# Altium project B100.PrjPcb (part 5 of 7)

## Sheet Filter Capacitors - IoT UART.SchDoc: IoT UART Filter Capacitors
size A4; ApprovedBy: Mehmet Günce Akkoyun; CheckedBy: Mehmet Günce Akkoyun; Author: Mehmet Günce Akkoyun; CompanyName: Ovoo Electronics; DrawnBy: Mehmet Günce Akkoyun; Engineer: Mehmet Günce Akkoyun; Organization: Ovoo Electronics; Address1: Necip Fazıl Mah. Ortaırmak Sok.; Address2: Birgül Apt. No: 19/6; Address3: Meram / Konya; Address4: Turkiye; DocumentNumber: 39; Revision: R06; SheetNumber: 39; SheetTotal: 54
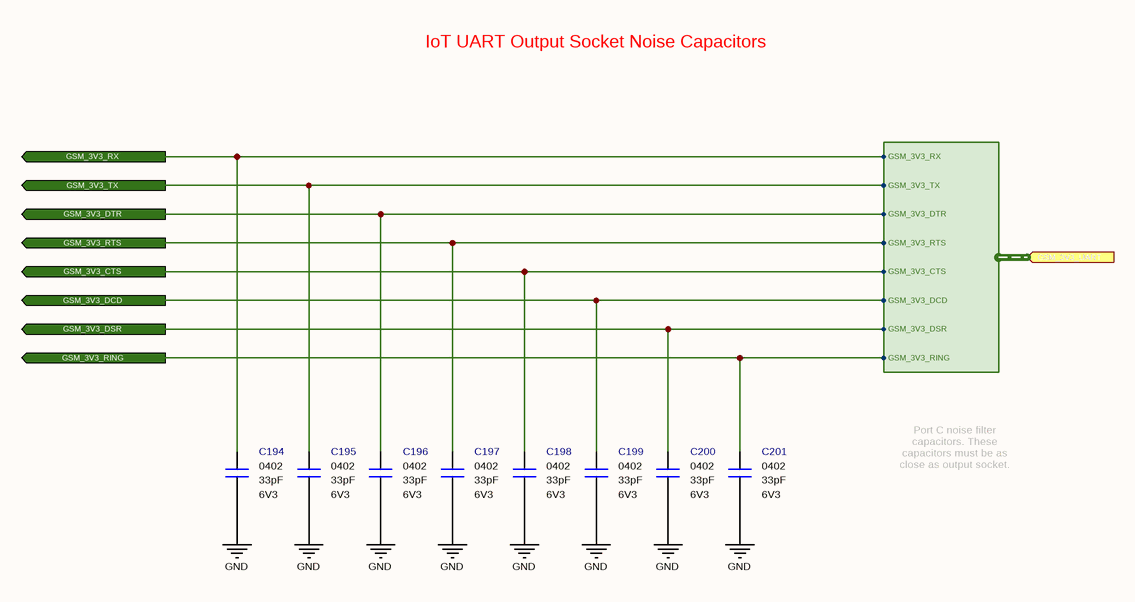
[diagram p46: Filter Capacitors - IoT UART.SchDoc]

### Parts
C194  value 33pF  Case: 0402  Voltage: 6V3  [CAPACITOR_0402]  (hidden comment: Multilayer Ceramic Capacitor)
C195  value 33pF  Case: 0402  Voltage: 6V3  [CAPACITOR_0402]  (hidden comment: Multilayer Ceramic Capacitor)
C196  value 33pF  Case: 0402  Voltage: 6V3  [CAPACITOR_0402]  (hidden comment: Multilayer Ceramic Capacitor)
C197  value 33pF  Case: 0402  Voltage: 6V3  [CAPACITOR_0402]  (hidden comment: Multilayer Ceramic Capacitor)
C198  value 33pF  Case: 0402  Voltage: 6V3  [CAPACITOR_0402]  (hidden comment: Multilayer Ceramic Capacitor)
C199  value 33pF  Case: 0402  Voltage: 6V3  [CAPACITOR_0402]  (hidden comment: Multilayer Ceramic Capacitor)
C200  value 33pF  Case: 0402  Voltage: 6V3  [CAPACITOR_0402]  (hidden comment: Multilayer Ceramic Capacitor)
C201  value 33pF  Case: 0402  Voltage: 6V3  [CAPACITOR_0402]  (hidden comment: Multilayer Ceramic Capacitor)

### Ports
GSM_3V3_CTS (out), GSM_3V3_DCD (out), GSM_3V3_DSR (out), GSM_3V3_DTR (out), GSM_3V3_RING (out), GSM_3V3_RTS (out), GSM_3V3_RX (out), GSM_3V3_TX (out), GSM_3V3_UART (in, harness GSM_3V3_UART)

### Harnesses
GSM_3V3_UART: GSM_3V3_RX, GSM_3V3_TX, GSM_3V3_DTR, GSM_3V3_RTS, GSM_3V3_CTS, GSM_3V3_DCD, GSM_3V3_DSR, GSM_3V3_RING

### Nets
GND: C194.1 C195.1 C196.1 C197.1 C198.1 C199.1 C200.1 C201.1
GSM_3V3_UART.GSM_3V3_CTS: C198.2 ; port GSM_3V3_CTS, port GSM_3V3_UART.GSM_3V3_CTS
GSM_3V3_UART.GSM_3V3_DCD: C199.2 ; port GSM_3V3_DCD, port GSM_3V3_UART.GSM_3V3_DCD
GSM_3V3_UART.GSM_3V3_DSR: C200.2 ; port GSM_3V3_DSR, port GSM_3V3_UART.GSM_3V3_DSR
GSM_3V3_UART.GSM_3V3_DTR: C196.2 ; port GSM_3V3_DTR, port GSM_3V3_UART.GSM_3V3_DTR
GSM_3V3_UART.GSM_3V3_RING: C201.2 ; port GSM_3V3_RING, port GSM_3V3_UART.GSM_3V3_RING
GSM_3V3_UART.GSM_3V3_RTS: C197.2 ; port GSM_3V3_RTS, port GSM_3V3_UART.GSM_3V3_RTS
GSM_3V3_UART.GSM_3V3_RX: C194.2 ; port GSM_3V3_RX, port GSM_3V3_UART.GSM_3V3_RX
GSM_3V3_UART.GSM_3V3_TX: C195.2 ; port GSM_3V3_TX, port GSM_3V3_UART.GSM_3V3_TX

### Notes on the sheet
- IoT UART Output Socket Noise Capacitors
- Port C noise filter capacitors. These capacitors must be as close as output socket.
- Title
- Size:
- Date:
- A4
- Number:
- Time:
- Revision:
- Sheet
- of
- File:

### Library data of the parts
C194-C201 = Capacitor - 33pF [0402-6V3]: as C102-C129 on sheet Module Output Sockets; Height: 0.5mm; Maximum Operating Temperature: +125; Minimum Operating Temperature: -55; ROHS: Yes; ComponentLink1Description: DataSheet; ComponentLink1URL: https://api.kemet.com/component-edge/download/datasheet/C0402C330J9RACAUTO.pdf; ComponentLink2Description: Mouser; ComponentLink2URL: https://www.mouser.com/Search/Refine.aspx?Keyword=80-C0402C330J9RAUTO; Supplier 1: Mouser; Supplier Part Number 1: 80-C0402C330J9RAUTO; Mouser Part Number: 80-C0402C330J9RAUTO

## Sheet Filter Capacitors - Port F.SchDoc: PORT F Filter Capacitors
size A4; ApprovedBy: Mehmet Günce Akkoyun; CheckedBy: Mehmet Günce Akkoyun; Author: Mehmet Günce Akkoyun; CompanyName: Ovoo Electronics; DrawnBy: Mehmet Günce Akkoyun; Engineer: Mehmet Günce Akkoyun; Organization: Ovoo Electronics; Address1: Necip Fazıl Mah. Ortaırmak Sok.; Address2: Birgül Apt. No: 19/6; Address3: Meram / Konya; Address4: Turkiye; DocumentNumber: 40; Revision: R06; SheetNumber: 40; SheetTotal: 54
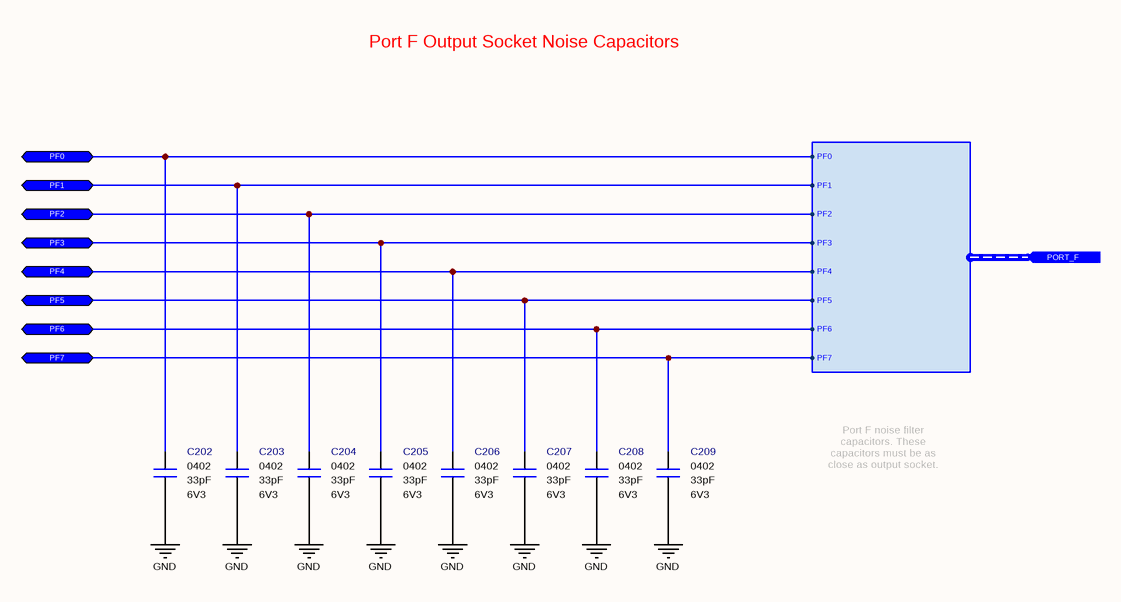
[diagram p47: Filter Capacitors - Port F.SchDoc]

### Parts
C202  value 33pF  Case: 0402  Voltage: 6V3  [CAPACITOR_0402]  (hidden comment: Multilayer Ceramic Capacitor)
C203  value 33pF  Case: 0402  Voltage: 6V3  [CAPACITOR_0402]  (hidden comment: Multilayer Ceramic Capacitor)
C204  value 33pF  Case: 0402  Voltage: 6V3  [CAPACITOR_0402]  (hidden comment: Multilayer Ceramic Capacitor)
C205  value 33pF  Case: 0402  Voltage: 6V3  [CAPACITOR_0402]  (hidden comment: Multilayer Ceramic Capacitor)
C206  value 33pF  Case: 0402  Voltage: 6V3  [CAPACITOR_0402]  (hidden comment: Multilayer Ceramic Capacitor)
C207  value 33pF  Case: 0402  Voltage: 6V3  [CAPACITOR_0402]  (hidden comment: Multilayer Ceramic Capacitor)
C208  value 33pF  Case: 0402  Voltage: 6V3  [CAPACITOR_0402]  (hidden comment: Multilayer Ceramic Capacitor)
C209  value 33pF  Case: 0402  Voltage: 6V3  [CAPACITOR_0402]  (hidden comment: Multilayer Ceramic Capacitor)

### Ports
PF0 (bidir), PF1 (bidir), PF2 (bidir), PF3 (bidir), PF4 (bidir), PF5 (bidir), PF6 (bidir), PF7 (bidir), PORT_F (in, harness PORT_F)

### Harnesses
PORT_F: PF0, PF1, PF2, PF3, PF4, PF5, PF7, PF6

### Nets
GND: C202.1 C203.1 C204.1 C205.1 C206.1 C207.1 C208.1 C209.1
PORT_F.PF0: C202.2 ; port PF0, port PORT_F.PF0
PORT_F.PF1: C203.2 ; port PF1, port PORT_F.PF1
PORT_F.PF2: C204.2 ; port PF2, port PORT_F.PF2
PORT_F.PF3: C205.2 ; port PF3, port PORT_F.PF3
PORT_F.PF4: C206.2 ; port PF4, port PORT_F.PF4
PORT_F.PF5: C207.2 ; port PF5, port PORT_F.PF5
PORT_F.PF6: C208.2 ; port PF6, port PORT_F.PF6
PORT_F.PF7: C209.2 ; port PF7, port PORT_F.PF7

### Notes on the sheet
- Port F Output Socket Noise Capacitors
- Port F noise filter capacitors. These capacitors must be as close as output socket.
- Title
- Size:
- Date:
- A4
- Number:
- Time:
- Revision:
- Sheet
- of
- File:

### Library data of the parts
C202-C209 = Capacitor - 33pF [0402-6V3]: as C102-C129 on sheet Module Output Sockets; Height: 0.5mm; Maximum Operating Temperature: +125; Minimum Operating Temperature: -55; ROHS: Yes; ComponentLink1Description: DataSheet; ComponentLink1URL: https://api.kemet.com/component-edge/download/datasheet/C0402C330J9RACAUTO.pdf; ComponentLink2Description: Mouser; ComponentLink2URL: https://www.mouser.com/Search/Refine.aspx?Keyword=80-C0402C330J9RAUTO; Supplier 1: Mouser; Supplier Part Number 1: 80-C0402C330J9RAUTO; Mouser Part Number: 80-C0402C330J9RAUTO

## Sheet Filter Capacitors - Serial Communication.SchDoc: Serial Communication Filter Capacitors
size A4; ApprovedBy: Mehmet Günce Akkoyun; CheckedBy: Mehmet Günce Akkoyun; Author: Mehmet Günce Akkoyun; CompanyName: Ovoo Electronics; DrawnBy: Mehmet Günce Akkoyun; Engineer: Mehmet Günce Akkoyun; Organization: Ovoo Electronics; Address1: Necip Fazıl Mah. Ortaırmak Sok.; Address2: Birgül Apt. No: 19/6; Address3: Meram / Konya; Address4: Turkiye; DocumentNumber: 41; Revision: R06; SheetNumber: 41; SheetTotal: 54
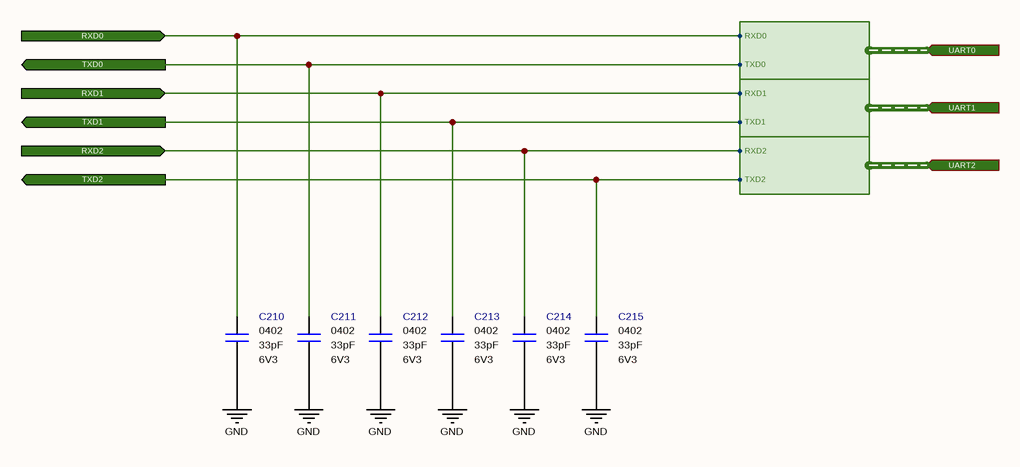
[diagram p48: Filter Capacitors - Serial Communication.SchDoc]

### Parts
C210  value 33pF  Case: 0402  Voltage: 6V3  [CAPACITOR_0402]  (hidden comment: Multilayer Ceramic Capacitor)
C211  value 33pF  Case: 0402  Voltage: 6V3  [CAPACITOR_0402]  (hidden comment: Multilayer Ceramic Capacitor)
C212  value 33pF  Case: 0402  Voltage: 6V3  [CAPACITOR_0402]  (hidden comment: Multilayer Ceramic Capacitor)
C213  value 33pF  Case: 0402  Voltage: 6V3  [CAPACITOR_0402]  (hidden comment: Multilayer Ceramic Capacitor)
C214  value 33pF  Case: 0402  Voltage: 6V3  [CAPACITOR_0402]  (hidden comment: Multilayer Ceramic Capacitor)
C215  value 33pF  Case: 0402  Voltage: 6V3  [CAPACITOR_0402]  (hidden comment: Multilayer Ceramic Capacitor)

### Ports
RXD0 (in), RXD1 (in), RXD2 (in), TXD0 (out), TXD1 (out), TXD2 (out), UART0 (in, harness UART0), UART1 (in, harness UART1), UART2 (in, harness UART2)

### Harnesses
UART0: RXD0, TXD0
UART1: RXD1, TXD1
UART2: RXD2, TXD2

### Nets
GND: C210.1 C211.1 C212.1 C213.1 C214.1 C215.1
UART0.RXD0: C210.2 ; port RXD0, port UART0.RXD0
UART0.TXD0: C211.2 ; port TXD0, port UART0.TXD0
UART1.RXD1: C212.2 ; port RXD1, port UART1.RXD1
UART1.TXD1: C213.2 ; port TXD1, port UART1.TXD1
UART2.RXD2: C214.2 ; port RXD2, port UART2.RXD2
UART2.TXD2: C215.2 ; port TXD2, port UART2.TXD2

### Notes on the sheet
- Title
- Size:
- Date:
- A4
- Number:
- Time:
- Revision:
- Sheet
- of
- File:

### Library data of the parts
C210-C215 = Capacitor - 33pF [0402-6V3]: as C102-C129 on sheet Module Output Sockets; Height: 0.5mm; Maximum Operating Temperature: +125; Minimum Operating Temperature: -55; ROHS: Yes; ComponentLink1Description: DataSheet; ComponentLink1URL: https://api.kemet.com/component-edge/download/datasheet/C0402C330J9RACAUTO.pdf; ComponentLink2Description: Mouser; ComponentLink2URL: https://www.mouser.com/Search/Refine.aspx?Keyword=80-C0402C330J9RAUTO; Supplier 1: Mouser; Supplier Part Number 1: 80-C0402C330J9RAUTO; Mouser Part Number: 80-C0402C330J9RAUTO

## Sheet Filter Capacitors - ADC Sensor.SchDoc: ADC Sensor Filter Capacitors
size A4; ApprovedBy: Mehmet Günce Akkoyun; CheckedBy: Mehmet Günce Akkoyun; Author: Mehmet Günce Akkoyun; CompanyName: Ovoo Electronics; DrawnBy: Mehmet Günce Akkoyun; Engineer: Mehmet Günce Akkoyun; Organization: Ovoo Electronics; Address1: Necip Fazıl Mah. Ortaırmak Sok.; Address2: Birgül Apt. No: 19/6; Address3: Meram / Konya; Address4: Turkiye; DocumentNumber: 42; Revision: R06; SheetNumber: 42; SheetTotal: 54
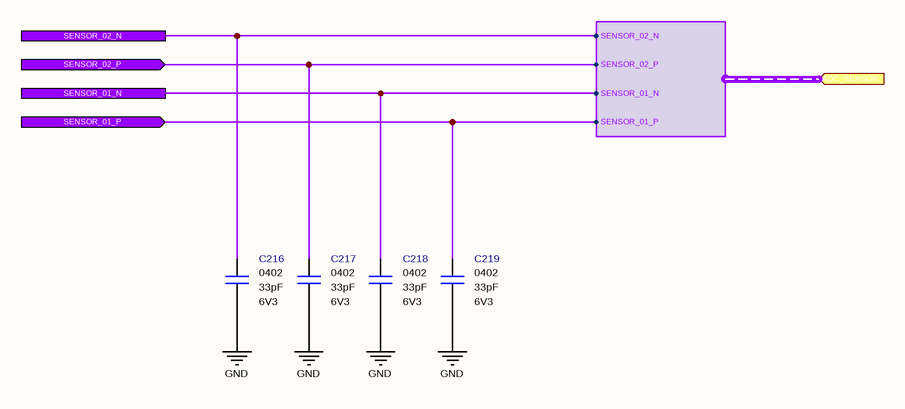
[diagram p49: Filter Capacitors - ADC Sensor.SchDoc]

### Parts
C216  value 33pF  Case: 0402  Voltage: 6V3  [CAPACITOR_0402]  (hidden comment: Multilayer Ceramic Capacitor)
C217  value 33pF  Case: 0402  Voltage: 6V3  [CAPACITOR_0402]  (hidden comment: Multilayer Ceramic Capacitor)
C218  value 33pF  Case: 0402  Voltage: 6V3  [CAPACITOR_0402]  (hidden comment: Multilayer Ceramic Capacitor)
C219  value 33pF  Case: 0402  Voltage: 6V3  [CAPACITOR_0402]  (hidden comment: Multilayer Ceramic Capacitor)

### Ports
ADC_SENSOR (in, harness ADC_SENSOR), SENSOR_01_N, SENSOR_01_P (in), SENSOR_02_N, SENSOR_02_P (in)

### Harnesses
ADC_SENSOR: SENSOR_01_P, SENSOR_01_N, SENSOR_02_P, SENSOR_02_N

### Nets
GND: C216.1 C217.1 C218.1 C219.1
NetC216_2: C216.2 ; port SENSOR_02_N, port ADC_SENSOR.SENSOR_02_N
NetC217_2: C217.2 ; port SENSOR_02_P, port ADC_SENSOR.SENSOR_02_P
NetC218_2: C218.2 ; port SENSOR_01_N, port ADC_SENSOR.SENSOR_01_N
NetC219_2: C219.2 ; port SENSOR_01_P, port ADC_SENSOR.SENSOR_01_P

### Notes on the sheet
- Engineer
- All Rights are reserved to Customer and Engineer. [2021]
- Size:
- Date:
- A4
- Project :
- Time:
- Sheet
- of
- Customer
- Product ID
- Module ID
- Version
- File:
- Revision

### Library data of the parts
C216-C219 = Capacitor - 33pF [0402-6V3]: as C102-C129 on sheet Module Output Sockets; Height: 0.5mm; Maximum Operating Temperature: +125; Minimum Operating Temperature: -55; ROHS: Yes; ComponentLink1Description: DataSheet; ComponentLink1URL: https://api.kemet.com/component-edge/download/datasheet/C0402C330J9RACAUTO.pdf; ComponentLink2Description: Mouser; ComponentLink2URL: https://www.mouser.com/Search/Refine.aspx?Keyword=80-C0402C330J9RAUTO; Supplier 1: Mouser; Supplier Part Number 1: 80-C0402C330J9RAUTO; Mouser Part Number: 80-C0402C330J9RAUTO

## Sheet Filter Capacitors - I2C.SchDoc: I2C Filter Capacitors
size A4; ApprovedBy: Mehmet Günce Akkoyun; CheckedBy: Mehmet Günce Akkoyun; Author: Mehmet Günce Akkoyun; CompanyName: Ovoo Electronics; DrawnBy: Mehmet Günce Akkoyun; Engineer: Mehmet Günce Akkoyun; Organization: Ovoo Electronics; Address1: Necip Fazıl Mah. Ortaırmak Sok.; Address2: Birgül Apt. No: 19/6; Address3: Meram / Konya; Address4: Turkiye; DocumentNumber: 43; Revision: R06; SheetNumber: 43; SheetTotal: 54
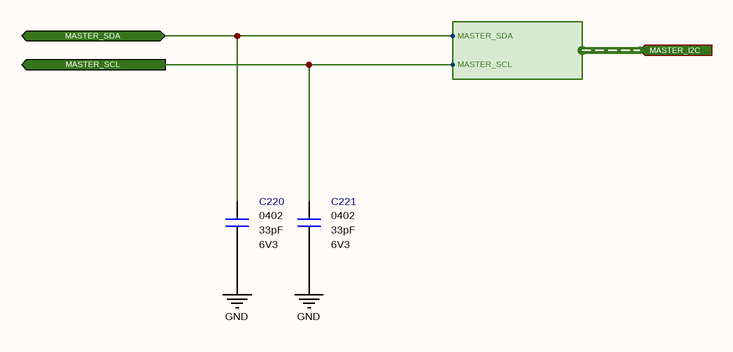
[diagram p50: Filter Capacitors - I2C.SchDoc]

### Parts
C220  value 33pF  Case: 0402  Voltage: 6V3  [CAPACITOR_0402]  (hidden comment: Multilayer Ceramic Capacitor)
C221  value 33pF  Case: 0402  Voltage: 6V3  [CAPACITOR_0402]  (hidden comment: Multilayer Ceramic Capacitor)

### Ports
MASTER_I2C (in, harness MASTER_I2C), MASTER_SCL (out), MASTER_SDA (bidir)

### Harnesses
MASTER_I2C: MASTER_SDA, MASTER_SCL

### Nets
GND: C220.1 C221.1
MASTER_I2C.MASTER_SCL: C221.2 ; port MASTER_SCL, port MASTER_I2C.MASTER_SCL
MASTER_I2C.MASTER_SDA: C220.2 ; port MASTER_SDA, port MASTER_I2C.MASTER_SDA

### Notes on the sheet
- Engineer
- All Rights are reserved to Customer and Engineer. [2021]
- Size:
- Date:
- A4
- Project :
- Time:
- Sheet
- of
- Customer
- Product ID
- Module ID
- Version
- File:
- Revision

### Library data of the parts
C220 C221 = Capacitor - 33pF [0402-6V3]: as C102-C129 on sheet Module Output Sockets; Height: 0.5mm; Maximum Operating Temperature: +125; Minimum Operating Temperature: -55; ROHS: Yes; ComponentLink1Description: DataSheet; ComponentLink1URL: https://api.kemet.com/component-edge/download/datasheet/C0402C330J9RACAUTO.pdf; ComponentLink2Description: Mouser; ComponentLink2URL: https://www.mouser.com/Search/Refine.aspx?Keyword=80-C0402C330J9RAUTO; Supplier 1: Mouser; Supplier Part Number 1: 80-C0402C330J9RAUTO; Mouser Part Number: 80-C0402C330J9RAUTO

## Sheet FOTA MicroController Power Switch.SchDoc: FOTA MicroController Latched Power Trigger
size A4; ApprovedBy: Mehmet Günce Akkoyun; CheckedBy: Mehmet Günce Akkoyun; Author: Mehmet Günce Akkoyun; CompanyName: Ovoo Electronics; DrawnBy: Mehmet Günce Akkoyun; Engineer: Mehmet Günce Akkoyun; Organization: Ovoo Electronics; Address1: Necip Fazıl Mah. Ortaırmak Sok.; Address2: Birgül Apt. No: 19/6; Address3: Meram / Konya; Address4: Turkiye; DocumentNumber: 44; Revision: R06; SheetNumber: 44; SheetTotal: 54
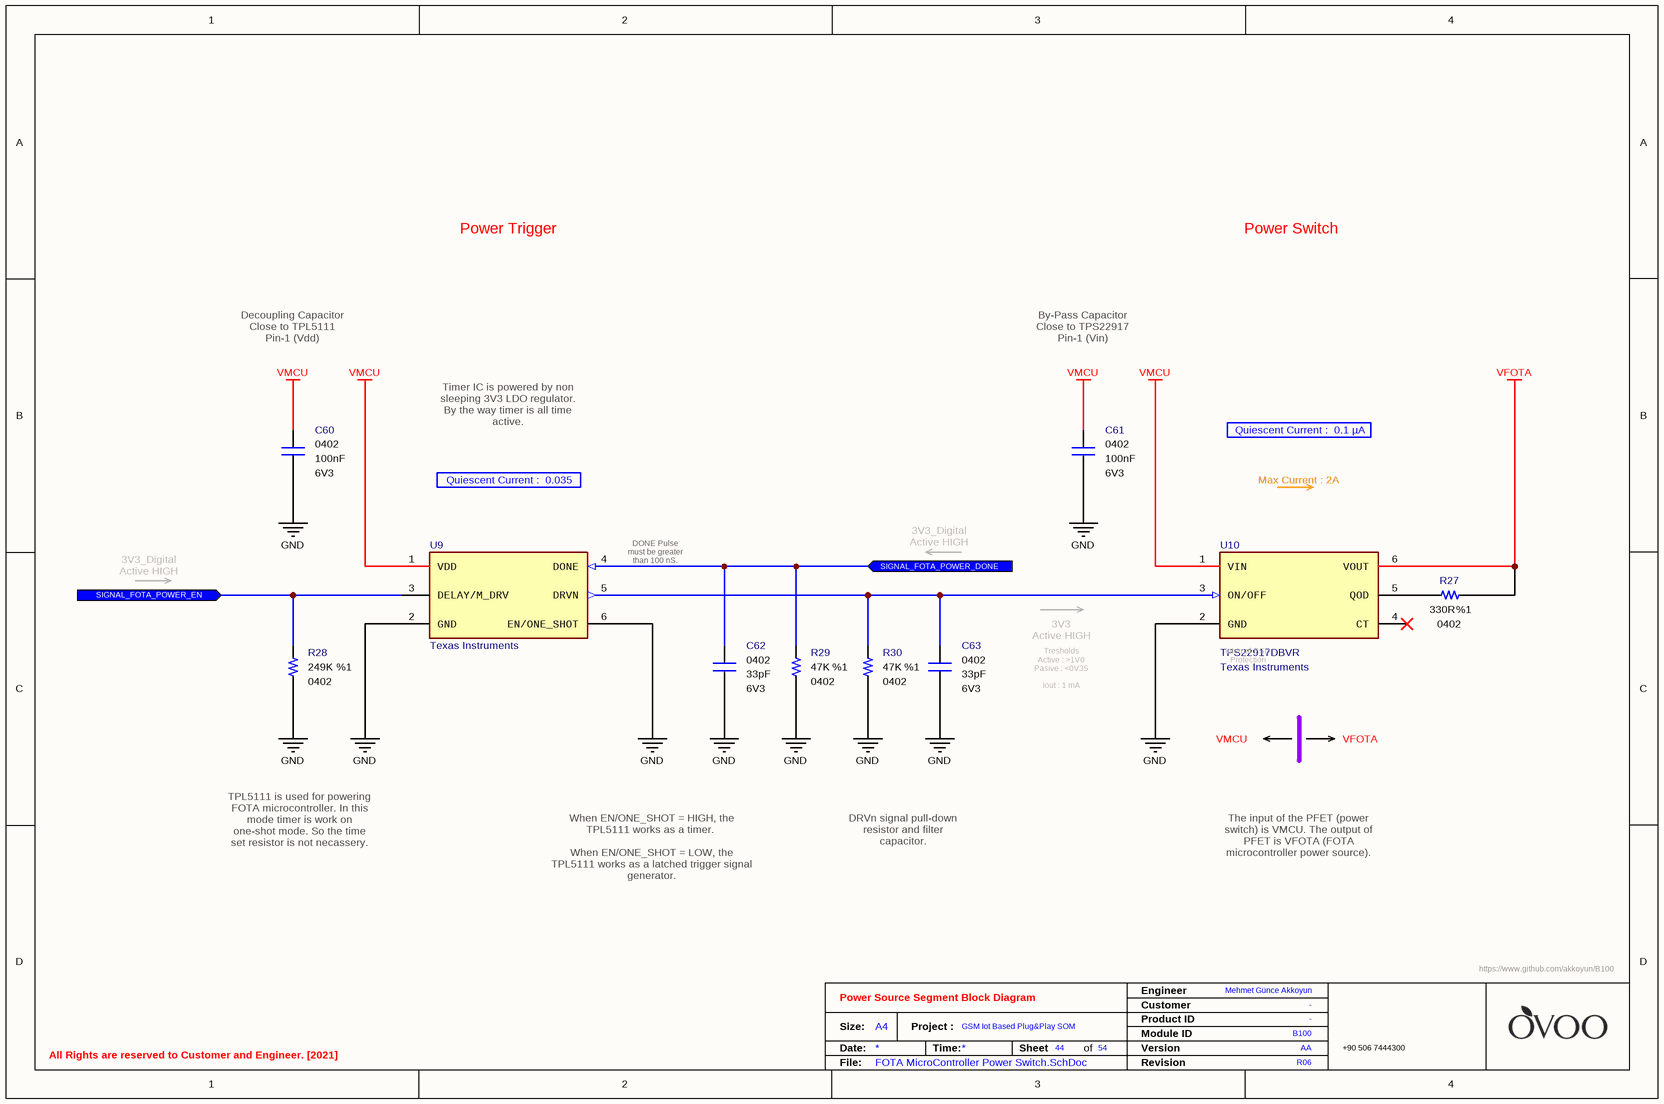
[diagram p51: FOTA MicroController Power Switch.SchDoc]

### Parts
C60  value 100nF  Case: 0402  Voltage: 6V3  [CAPACITOR_0402]  (hidden comment: Multilayer Ceramic Capacitor)
C61  value 100nF  Case: 0402  Voltage: 6V3  [CAPACITOR_0402]  (hidden comment: Multilayer Ceramic Capacitor)
C62  value 33pF  Case: 0402  Voltage: 6V3  [CAPACITOR_0402]  (hidden comment: Multilayer Ceramic Capacitor)
C63  value 33pF  Case: 0402  Voltage: 6V3  [CAPACITOR_0402]  (hidden comment: Multilayer Ceramic Capacitor)
R27  value 330R  Tolerance: %1  Case: 0402  [RESISTOR_0402]  (hidden comment: Thick Film Resistor)
R28  value 249K  Tolerance: %1  Case: 0402  [RESISTOR_0402]  (hidden comment: Thick Film Resistor)
R29  value 47K  Tolerance: %1  Case: 0402  [RESISTOR_0402]  (hidden comment: Thick Film Resistor)
R30  value 47K  Tolerance: %1  Case: 0402  [RESISTOR_0402]  (hidden comment: Thick Film Resistor)
U9  Manufacturer Name: Texas Instruments  [SOT-23-6]  (hidden comment: Nanopower Timer IC)
U10  Manufacturer Part Number: TPS22917DBVR  Manufacturer Name: Texas Instruments  [SOT-23-6]  (hidden comment: Power Switch)

### Ports
SIGNAL_FOTA_POWER_DONE (in), SIGNAL_FOTA_POWER_EN (in)

### Nets
GND: C60.1 C61.2 C62.1 C63.1 R28.1 R29.1 R30.1 U9.2(GND) U9.6(EN/ONE_SHOT) U10.2(GND)
VFOTA: R27.1 U10.6(VOUT)
VMCU: C60.2 C61.1 U9.1(VDD) U10.1(VIN)
SIGNAL_FOTA_POWER_DONE: C62.2 R29.2 U9.4(DONE) ; port SIGNAL_FOTA_POWER_DONE
SIGNAL_FOTA_POWER_EN: R28.2 U9.3(DELAY/M_DRV) ; port SIGNAL_FOTA_POWER_EN
NetC63_2: C63.2 R30.2 U9.5(DRVN) U10.3(ON/OFF)
NetR27_2: R27.2 U10.5(QOD)

Not connected (* = marked no-connect by the designer): U10 4(CT)*

### Notes on the sheet
- Power Trigger
- Power Switch
- Decoupling Capacitor
  Close to TPL5111
  Pin-1 (Vdd)
- By-Pass Capacitor
  Close to TPS22917
  Pin-1 (Vin)
- Timer IC is powered by non sleeping 3V3 LDO regulator. By the way timer is all time active.
- Quiescent Current :  0.1 µA
- Quiescent Current :  0.035 µA
- 3V3_Digital
  Active HIGH
- Max Current : 2A
- (near U9) DONE Pulse must be greater than 100 nS.
- Tresholds
  Active : >1V0
  Pasive : <0V35
  Iout : 1 mA
- 3V3
  Active HIGH
- (near U10) Internal ESD Protection
- VMCU
- VFOTA
- DRVn signal pull-down resistor and filter capacitor.
- TPL5111 is used for powering FOTA microcontroller. In this mode timer is work on one-shot mode. So the time set resistor is not necassery.
- When EN/ONE_SHOT = HIGH, the TPL5111 works as a timer.
  When EN/ONE_SHOT = LOW, the TPL5111 works as a latched trigger signal generator.
- The input of the PFET (power switch) is VMCU. The output of PFET is VFOTA (FOTA microcontroller power source).
- Engineer
- All Rights are reserved to Customer and Engineer. [2021]
- Size:
- Date:
- A4
- Project :
- Time:
- Sheet
- of
- Customer
- Product ID
- Module ID
- Version
- File:
- Revision

### Library data of the parts
C60 C61 = Capacitor - 100nF [0402-6V3]: Capacitor - 100nF [0402-6V3] (Ceramic); Manufacturer Name: AVX; Manufacturer Part Number: 04026D104KAT4A; Dielectric: X5R; Tolerance: %10; Height: 0.25mm; ComponentLink1Description: Mouser; ComponentLink1URL: https://www.mouser.com.tr/ProductDetail/AVX/04026D104KAT4A?qs=sGAEpiMZZMs0AnBnWHyRQPg4iYkCw7IMED%2F4kpqgf7w%3D; ComponentLink2Description: DataSheet; ComponentLink2URL: https://www.mouser.com.tr/datasheet/2/40/cx5r-776519.pdf; ROHS: Yes; Maximum Operating Temperature: +85; Minimum Operating Temperature: -55; Supplier 1: Avnet; Supplier Part Number 1: 04026D104KAT4A; Mouser Part Number: 581-04026D104KAT4A
C62 C63 = Capacitor - 33pF [0402-6V3]: Capacitor - 33pF [0402] (Ceramic); Manufacturer Name: Kemet; Manufacturer Part Number: C0402C330J9RACAUTO; Dielectric: X7R; Tolerance: 10%; Height: 0.5mm; Maximum Operating Temperature: +125; Minimum Operating Temperature: -55; ROHS: Yes; ComponentLink1Description: DataSheet; ComponentLink1URL: https://api.kemet.com/component-edge/download/datasheet/C0402C330J9RACAUTO.pdf; ComponentLink2Description: Mouser; ComponentLink2URL: https://www.mouser.com/Search/Refine.aspx?Keyword=80-C0402C330J9RAUTO; Supplier 1: Mouser; Supplier Part Number 1: 80-C0402C330J9RAUTO; Mouser Part Number: 80-C0402C330J9RAUTO
R27 = Resistor - 330R: Thick Film Resistors - SMD 1/16 W 330 Ohm 1%; Manufacturer Name: Vishay; Manufacturer Part Number: CRCW0402330RFKED; Height: 0.4mm; ComponentLink1Description: DataSheet; ComponentLink1URL: https://www.mouser.com.tr/datasheet/2/427/dcrcwe3-1762152.pdf; ComponentLink2Description: Mouser; ComponentLink2URL: https://www.mouser.com.tr/ProductDetail/Vishay-Dale/CRCW0402330RFKED?qs=sGAEpiMZZMu61qfTUdNhG2DpbjADlD3GGS6SwBlLi5Q%3D; Supplier 1: Mouser; Supplier 2: Digi-Key; Supplier Part Number 2: 541-330LCT-ND; Supplier Part Number 1: 71-CRCW0402-330-E3; Mouser Part Number: 71-CRCW0402-330-E3
R28 = Resistor - 249K: Thick Film Resistors - SMD 1/16 W 249 Kohms 1%; Manufacturer Name: Vishay; Manufacturer Part Number: CRCW0402249KFKED; Height: 0.35mm; ComponentLink1Description: DataSheet; ComponentLink1URL: https://www.mouser.com.tr/datasheet/2/427/dcrcwe3-1762152.pdf; ComponentLink2Description: Mouser; ComponentLink2URL: https://www.mouser.com.tr/ProductDetail/Vishay-Dale/CRCW0402249KFKED?qs=sGAEpiMZZMu61qfTUdNhG2DpbjADlD3GEiYBObatoAI%3D; Supplier 1: Mouser; Supplier 2: Digi-Key; Supplier Part Number 1: 71-CRCW0402-249K-E3; Supplier Part Number 2: 541-249KLCT-ND; Mouser Part Number: 71-CRCW0402-249K-E3
R29 R30 = Resistor - 47K: Thick Film Resistors - SMD 1/16 W 47 Kohms 1%; Manufacturer Name: Vishay; Manufacturer Part Number: CRCW040247K0FKED; Height: 0.4mm; ComponentLink1Description: DataSheet; ComponentLink1URL: https://www.mouser.com.tr/datasheet/2/427/dcrcwe3-1762152.pdf; ComponentLink2Description: Mouser; ComponentLink2URL: https://www.mouser.com.tr/ProductDetail/Vishay-Dale/CRCW040247K0FKED?qs=sGAEpiMZZMu61qfTUdNhG2DpbjADlD3GL%252B3h1elTxqU%3D; Supplier 1: Mouser; Supplier 2: Digi-Key; Supplier Part Number 1: 71-CRCW040247K0FKEDH; Supplier Part Number 2: 541-47.0KYCT-ND; Mouser Part Number: 71-CRCW0402-47K-E3
U9 = IC - TPL5111: Timers & Support Products Ultra Low Power System Timer (35 nA) for Power Gating in duty cycled applications.; Manufacturer Part Number: TPL5111DDCT; Supply Voltage - Min: 1.8V; Supply Voltage - Max: 5.5V; Height: 1.1mm; ROHS: Yes; Minimum Operating Temperature: -40; Maximum Operating Temperature: +105; ComponentLink1Description: DataSheet; ComponentLink1URL: http://www.ti.com/general/docs/suppproductinfo.tsp?distId=26&gotoUrl=http%3A%2F%2Fwww.ti.com%2Flit%2Fgpn%2Ftpl5111; ComponentLink2Description: Mouser; ComponentLink2URL: https://www.mouser.com/Search/Refine.aspx?Keyword=595-TPL5111DDCT; Supplier 1: Mouser; Supplier 2: Arrow; Supplier 3: Farnell; Supplier 4: Digi-Key; Supplier 5: Newark; Supplier Part Number 1: 595-TPL5111DDCT; Supplier Part Number 2: TPL5111DDCT; Supplier Part Number 3: 3006922; Supplier Part Number 4: 296-42621-1-ND; Supplier Part Number 5: 28AH5709; Mouser Part Number: 595-TPL5111DDCT; Case: SOT-23-6
U10 = IC - TPS22917DBVR: Power Switch MosFet; Height: 1.45mm; ComponentLink1Description: DataSheet; ComponentLink1URL: http://www.ti.com/lit/gpn/tps22917; ComponentLink2Description: Mouser; ComponentLink2URL: https://www.mouser.com/Search/Refine.aspx?Keyword=595-TPS22917DBVR; Supplier 1: Mouser; Supplier 2: Digi-Key; Supplier Part Number 1: 595-TPS22917DBVR; Supplier Part Number 2: 296-50498-1-ND; Mouser Part Number: 595-TPS22917DBVR; Case: SOT-23-6

## Sheet SD Card.SchDoc: SD Card & Select Switch
size A4; ApprovedBy: Mehmet Günce Akkoyun; CheckedBy: Mehmet Günce Akkoyun; Author: Mehmet Günce Akkoyun; CompanyName: Ovoo Electronics; DrawnBy: Mehmet Günce Akkoyun; Engineer: Mehmet Günce Akkoyun; Organization: Ovoo Electronics; Address1: Necip Fazıl Mah. Ortaırmak Sok.; Address2: Birgül Apt. No: 19/6; Address3: Meram / Konya; Address4: Turkiye; DocumentNumber: 46; Revision: R06; SheetNumber: 46; SheetTotal: 54
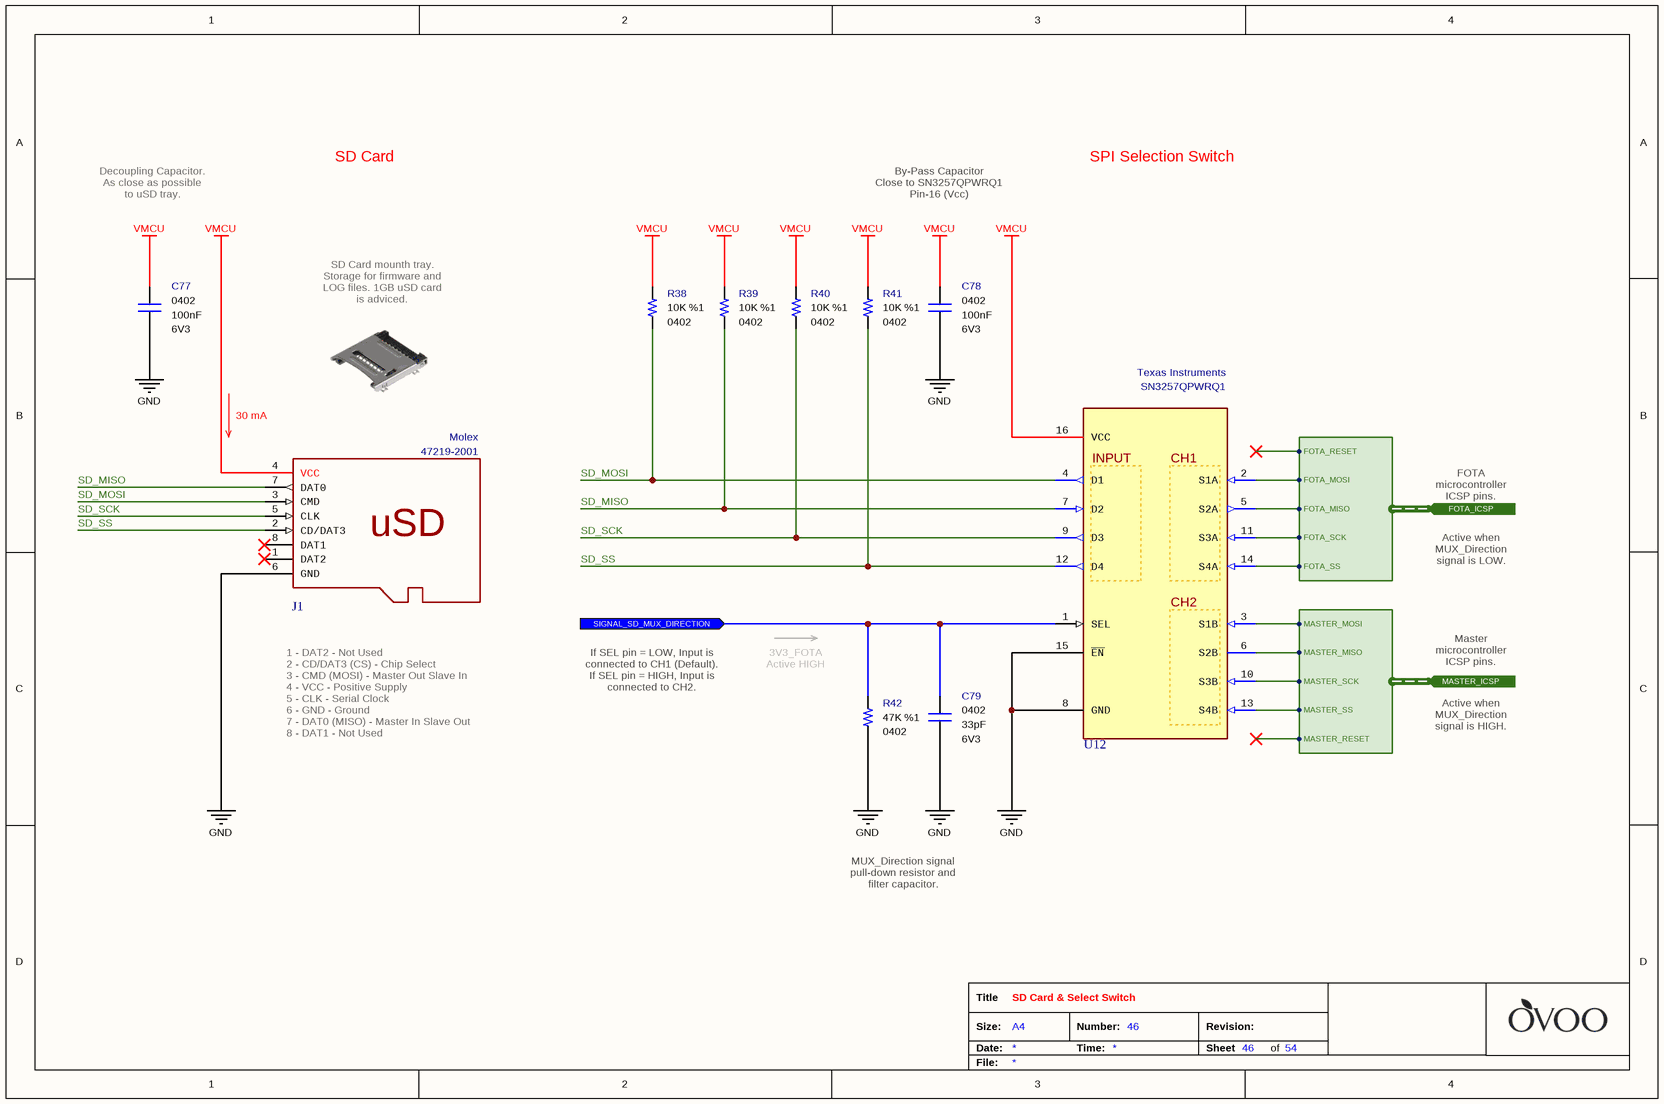
[diagram p52: SD Card.SchDoc]

### Parts
C77  value 100nF  Case: 0402  Voltage: 6V3  [CAPACITOR_0402]  (hidden comment: Multilayer Ceramic Capacitor)
C78  value 100nF  Case: 0402  Voltage: 6V3  [CAPACITOR_0402]  (hidden comment: Multilayer Ceramic Capacitor)
C79  value 33pF  Case: 0402  Voltage: 6V3  [CAPACITOR_0402]  (hidden comment: Multilayer Ceramic Capacitor)
J1  Manufacturer Part Number: 47219-2001  Manufacturer Name: Molex  [Connector - SD Module]  (hidden comment: Memory Card Connectors)
R38  value 10K  Tolerance: %1  Case: 0402  [RESISTOR_0402]  (hidden comment: Thick Film Resistor)
R39  value 10K  Tolerance: %1  Case: 0402  [RESISTOR_0402]  (hidden comment: Thick Film Resistor)
R40  value 10K  Tolerance: %1  Case: 0402  [RESISTOR_0402]  (hidden comment: Thick Film Resistor)
R41  value 10K  Tolerance: %1  Case: 0402  [RESISTOR_0402]  (hidden comment: Thick Film Resistor)
R42  value 47K  Tolerance: %1  Case: 0402  [RESISTOR_0402]  (hidden comment: Thick Film Resistor)
U12  Manufacturer Part Number: SN3257QPWRQ1  Manufacturer Name: Texas Instruments  [TSSOP-16]  (hidden comment: SPI Switch IC)

### Ports
FOTA_ICSP (in, harness FOTA_ICSP), MASTER_ICSP (in, harness MASTER_ICSP), SIGNAL_SD_MUX_DIRECTION (in)

### Harnesses
FOTA_ICSP: FOTA_RESET, FOTA_SCK, FOTA_MISO, FOTA_MOSI, FOTA_SS
MASTER_ICSP: MASTER_RESET, MASTER_SCK, MASTER_MISO, MASTER_MOSI, MASTER_SS

### Nets
GND: C77.1 C78.2 C79.1 J1.6(GND) R42.1 U12.8(GND) U12.15(~{EN})
VMCU: C77.2 C78.1 J1.4(VCC) R38.2 R39.2 R40.2 R41.2 U12.16(VCC)
FOTA_ICSP.FOTA_MISO: U12.5(S2A) ; port FOTA_ICSP.FOTA_MISO
FOTA_ICSP.FOTA_MOSI: U12.2(S1A) ; port FOTA_ICSP.FOTA_MOSI
FOTA_ICSP.FOTA_SCK: U12.11(S3A) ; port FOTA_ICSP.FOTA_SCK
FOTA_ICSP.FOTA_SS: U12.14(S4A) ; port FOTA_ICSP.FOTA_SS
MASTER_ICSP.MASTER_MISO: U12.6(S2B) ; port MASTER_ICSP.MASTER_MISO
MASTER_ICSP.MASTER_MOSI: U12.3(S1B) ; port MASTER_ICSP.MASTER_MOSI
MASTER_ICSP.MASTER_SCK: U12.10(S3B) ; port MASTER_ICSP.MASTER_SCK
MASTER_ICSP.MASTER_SS: U12.13(S4B) ; port MASTER_ICSP.MASTER_SS
SD_MISO: J1.7(DAT0) R39.1 U12.7(D2)
SD_MOSI: J1.3(CMD) R38.1 U12.4(D1)
SD_SCK: J1.5(CLK) R40.1 U12.9(D3)
SD_SS: J1.2(CD/DAT3) R41.1 U12.12(D4)
SIGNAL_SD_MUX_DIRECTION: C79.2 R42.2 U12.1(SEL) ; port SIGNAL_SD_MUX_DIRECTION

Not connected (* = marked no-connect by the designer): J1 1(DAT2)* 8(DAT1)*

### Notes on the sheet
- SD Card
- SPI Selection Switch
- Decoupling Capacitor. As close as possible to uSD tray.
- By-Pass Capacitor
  Close to SN3257QPWRQ1
  Pin-16 (Vcc)
- SD Card mounth tray. Storage for firmware and LOG files. 1GB uSD card is adviced.
- 30 mA
- FOTA microcontroller
  ICSP pins.
- Active when MUX_Direction signal is LOW.
- If SEL pin = LOW, Input is connected to CH1 (Default).
  If SEL pin = HIGH, Input is connected to CH2.
- (near R42) 3V3_FOTA
  Active HIGH
- Master microcontroller
  ICSP pins.
- 1 - DAT2 - Not Used
  2 - CD/DAT3 (CS) - Chip Select
  3 - CMD (MOSI) - Master Out Slave In
  4 - VCC - Positive Supply
  5 - CLK - Serial Clock
  6 - GND - Ground
  7 - DAT0 (MISO) - Master In Slave Out
  8 - DAT1 - Not Used
- Active when MUX_Direction signal is HIGH.
- MUX_Direction signal pull-down resistor and filter capacitor.
- Title
- Size:
- Date:
- A4
- Number:
- Time:
- Revision:
- Sheet
- of
- File:
- (in symbol Connector - SD Slot) uSD
- (in symbol IC - SN3257QPWRQ1) INPUT; CH1; CH2

### Library data of the parts
C77 C78 = Capacitor - 100nF [0402-6V3]: as C60 on sheet FOTA MicroController Power Switch; Height: 0.25mm; ComponentLink1Description: Mouser; ComponentLink1URL: https://www.mouser.com.tr/ProductDetail/AVX/04026D104KAT4A?qs=sGAEpiMZZMs0AnBnWHyRQPg4iYkCw7IMED%2F4kpqgf7w%3D; ComponentLink2Description: DataSheet; ComponentLink2URL: https://www.mouser.com.tr/datasheet/2/40/cx5r-776519.pdf; ROHS: Yes; Maximum Operating Temperature: +85; Minimum Operating Temperature: -55; Supplier 1: Avnet; Supplier Part Number 1: 04026D104KAT4A; Mouser Part Number: 581-04026D104KAT4A
C79 = Capacitor - 33pF [0402-6V3]: as C62 on sheet FOTA MicroController Power Switch; Height: 0.5mm; Maximum Operating Temperature: +125; Minimum Operating Temperature: -55; ROHS: Yes; ComponentLink1Description: DataSheet; ComponentLink1URL: https://api.kemet.com/component-edge/download/datasheet/C0402C330J9RACAUTO.pdf; ComponentLink2Description: Mouser; ComponentLink2URL: https://www.mouser.com/Search/Refine.aspx?Keyword=80-C0402C330J9RAUTO; Supplier 1: Mouser; Supplier Part Number 1: 80-C0402C330J9RAUTO; Mouser Part Number: 80-C0402C330J9RAUTO
J1 = Connector - SD Slot: Memory Card Connectors TFR READER (HINGE TYPE); Card Type: microSD; Supplier 1: Avnet; Supplier 2: Farnell; Supplier 3: Newark; Supplier 4: Digi-Key; Supplier Part Number 2: 2614940; Supplier Part Number 1: 0472192001; Supplier Part Number 3: 32T4523; Supplier Part Number 4: WM6698CT-ND; Mouser Part Number: 538-47219-2001; Case: SMD
R38-R41 = Resistor - 10K: Thick Film Resistors - SMD 1/16 W 10 Kohms 1%; Manufacturer Name: Vishay; Manufacturer Part Number: CRCW040210K0FKED; Height: 0.4mm; ComponentLink1Description: DataSheet; ComponentLink1URL: https://www.mouser.com.tr/datasheet/2/427/dcrcwe3-1762152.pdf; ComponentLink2Description: Mouser; ComponentLink2URL: https://www.mouser.com.tr/ProductDetail/Vishay-Dale/CRCW040210K0FKED?qs=sGAEpiMZZMu61qfTUdNhG2DpbjADlD3GcalbOv9utCY%3D; Supplier 1: Mouser; Supplier 2: Digi-Key; Supplier Part Number 1: 71-CRCW040210K0FKEDH; Supplier Part Number 2: 541-10.0KYCT-ND; Mouser Part Number: 71-CRCW0402-10K-E3
R42 = Resistor - 47K: as R29 on sheet FOTA MicroController Power Switch; Height: 0.4mm; ComponentLink1Description: DataSheet; ComponentLink1URL: https://www.mouser.com.tr/datasheet/2/427/dcrcwe3-1762152.pdf; ComponentLink2Description: Mouser; ComponentLink2URL: https://www.mouser.com.tr/ProductDetail/Vishay-Dale/CRCW040247K0FKED?qs=sGAEpiMZZMu61qfTUdNhG2DpbjADlD3GL%252B3h1elTxqU%3D; Supplier 1: Mouser; Supplier 2: Digi-Key; Supplier Part Number 1: 71-CRCW040247K0FKEDH; Supplier Part Number 2: 541-47.0KYCT-ND; Mouser Part Number: 71-CRCW0402-47K-E3
U12 = IC - SN3257QPWRQ1: Analogue Switch ICs 2:1 (SPDT), 4-channel switch with 1.8-V logic 16-TSSOP -40 to 125; Mouser Part Number: 595-SN3257QPWRQ1; ComponentLink1Description: DataSheet; ComponentLink1URL: http://www.ti.com/lit/ds/symlink/tca9546a.pdf; ComponentLink2Description: Mouser; ComponentLink2URL: https://eu.mouser.com/ProductDetail/Texas-Instruments/TCA9546APWR?qs=sGAEpiMZZMu0f%252BT2bkVfuqY85%252BzcFu6eZaMCXRqwDMg%3D; Minimum Operating Temperature: -40; Maximum Operating Temperature: +125; Supplier 1: Mouser; Supplier 2: Digi-Key; Supplier Part Number 1: 595-SN3257QPWRQ1; Supplier Part Number 2: 296-SN3257QPWRQ1CT-ND; Case: TSSOP-16

## Sheet ICSP Burn Buffer.SchDoc: FOTA Burn Buffer
size A4; ApprovedBy: Mehmet Günce Akkoyun; CheckedBy: Mehmet Günce Akkoyun; Author: Mehmet Günce Akkoyun; CompanyName: Ovoo Electronics; DrawnBy: Mehmet Günce Akkoyun; Engineer: Mehmet Günce Akkoyun; Organization: Ovoo Electronics; Address1: Necip Fazıl Mah. Ortaırmak Sok.; Address2: Birgül Apt. No: 19/6; Address3: Meram / Konya; Address4: Turkiye; DocumentNumber: 47; Revision: R06; SheetNumber: 47; SheetTotal: 54
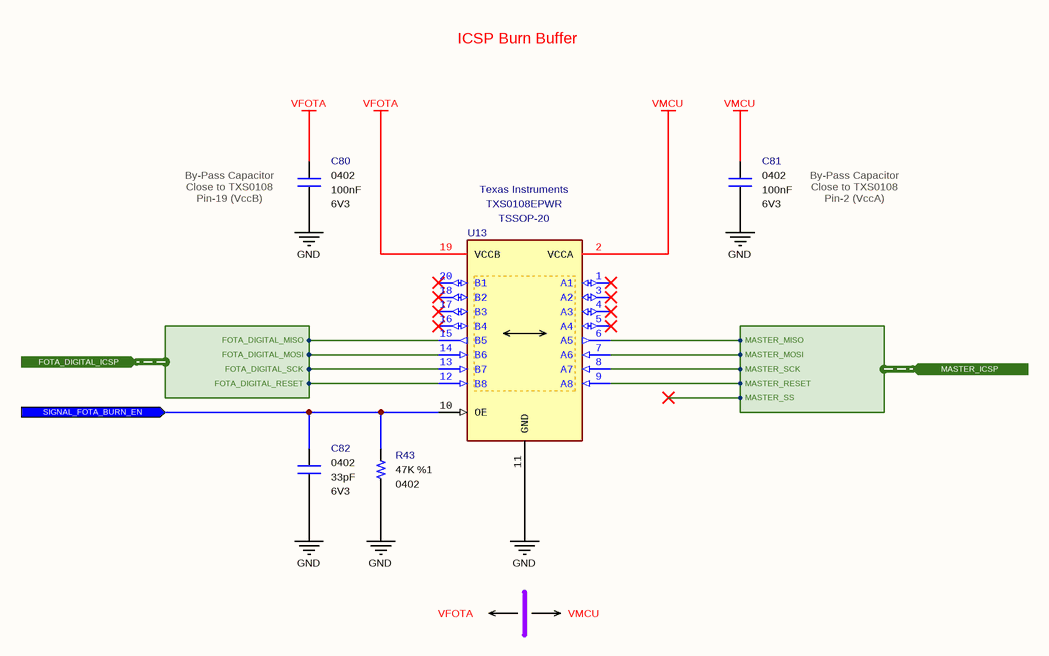
[diagram p53: ICSP Burn Buffer.SchDoc]

### Parts
C80  value 100nF  Case: 0402  Voltage: 6V3  [CAPACITOR_0402]  (hidden comment: Multilayer Ceramic Capacitor)
C81  value 100nF  Case: 0402  Voltage: 6V3  [CAPACITOR_0402]  (hidden comment: Multilayer Ceramic Capacitor)
C82  value 33pF  Case: 0402  Voltage: 6V3  [CAPACITOR_0402]  (hidden comment: Multilayer Ceramic Capacitor)
R43  value 47K  Tolerance: %1  Case: 0402  [RESISTOR_0402]  (hidden comment: Thick Film Resistor)
U13  Manufacturer Part Number: TXS0108EPWR  Manufacturer Name: Texas Instruments  [TSSOP-20]  (hidden comment: Voltage Level Shifter)

### Ports
FOTA_DIGITAL_ICSP (in, harness FOTA_DIGITAL_ICSP), MASTER_ICSP (in, harness MASTER_ICSP), SIGNAL_FOTA_BURN_EN (in)

### Harnesses
FOTA_DIGITAL_ICSP: FOTA_DIGITAL_SCK, FOTA_DIGITAL_MOSI, FOTA_DIGITAL_MISO, FOTA_DIGITAL_RESET
MASTER_ICSP: MASTER_RESET, MASTER_SCK, MASTER_MISO, MASTER_MOSI, MASTER_SS

### Nets
GND: C80.1 C81.1 C82.2 R43.1 U13.11(GND)
VFOTA: C80.2 U13.19(VCCB)
VMCU: C81.2 U13.2(VCCA)
FOTA_DIGITAL_ICSP.FOTA_DIGITAL_MISO: U13.15(B5) ; port FOTA_DIGITAL_ICSP.FOTA_DIGITAL_MISO
FOTA_DIGITAL_ICSP.FOTA_DIGITAL_MOSI: U13.14(B6) ; port FOTA_DIGITAL_ICSP.FOTA_DIGITAL_MOSI
FOTA_DIGITAL_ICSP.FOTA_DIGITAL_RESET: U13.12(B8) ; port FOTA_DIGITAL_ICSP.FOTA_DIGITAL_RESET
FOTA_DIGITAL_ICSP.FOTA_DIGITAL_SCK: U13.13(B7) ; port FOTA_DIGITAL_ICSP.FOTA_DIGITAL_SCK
MASTER_ICSP.MASTER_MISO: U13.6(A5) ; port MASTER_ICSP.MASTER_MISO
MASTER_ICSP.MASTER_MOSI: U13.7(A6) ; port MASTER_ICSP.MASTER_MOSI
MASTER_ICSP.MASTER_RESET: U13.9(A8) ; port MASTER_ICSP.MASTER_RESET
MASTER_ICSP.MASTER_SCK: U13.8(A7) ; port MASTER_ICSP.MASTER_SCK
SIGNAL_FOTA_BURN_EN: C82.1 R43.2 U13.10(OE) ; port SIGNAL_FOTA_BURN_EN

Not connected (* = marked no-connect by the designer): U13 1(A1)* 3(A2)* 4(A3)* 5(A4)* 16(B4)* 17(B3)* 18(B2)* 20(B1)*

### Notes on the sheet
- ICSP Burn Buffer
- (near C80) By-Pass Capacitor
  Close to TXS0108
  Pin-19 (VccB)
- By-Pass Capacitor
  Close to TXS0108
  Pin-2 (VccA)
- VFOTA
- VMCU
- Title
- Size:
- Date:
- A4
- Number:
- Time:
- Revision:
- Sheet
- of
- File:

### Library data of the parts
C80 C81 = Capacitor - 100nF [0402-6V3]: as C60 on sheet FOTA MicroController Power Switch; Height: 0.25mm; ComponentLink1Description: Mouser; ComponentLink1URL: https://www.mouser.com.tr/ProductDetail/AVX/04026D104KAT4A?qs=sGAEpiMZZMs0AnBnWHyRQPg4iYkCw7IMED%2F4kpqgf7w%3D; ComponentLink2Description: DataSheet; ComponentLink2URL: https://www.mouser.com.tr/datasheet/2/40/cx5r-776519.pdf; ROHS: Yes; Maximum Operating Temperature: +85; Minimum Operating Temperature: -55; Supplier 1: Avnet; Supplier Part Number 1: 04026D104KAT4A; Mouser Part Number: 581-04026D104KAT4A
C82 = Capacitor - 33pF [0402-6V3]: as C62 on sheet FOTA MicroController Power Switch; Height: 0.5mm; Maximum Operating Temperature: +125; Minimum Operating Temperature: -55; ROHS: Yes; ComponentLink1Description: DataSheet; ComponentLink1URL: https://api.kemet.com/component-edge/download/datasheet/C0402C330J9RACAUTO.pdf; ComponentLink2Description: Mouser; ComponentLink2URL: https://www.mouser.com/Search/Refine.aspx?Keyword=80-C0402C330J9RAUTO; Supplier 1: Mouser; Supplier Part Number 1: 80-C0402C330J9RAUTO; Mouser Part Number: 80-C0402C330J9RAUTO
R43 = Resistor - 47K: as R29 on sheet FOTA MicroController Power Switch; Height: 0.4mm; ComponentLink1Description: DataSheet; ComponentLink1URL: https://www.mouser.com.tr/datasheet/2/427/dcrcwe3-1762152.pdf; ComponentLink2Description: Mouser; ComponentLink2URL: https://www.mouser.com.tr/ProductDetail/Vishay-Dale/CRCW040247K0FKED?qs=sGAEpiMZZMu61qfTUdNhG2DpbjADlD3GL%252B3h1elTxqU%3D; Supplier 1: Mouser; Supplier 2: Digi-Key; Supplier Part Number 1: 71-CRCW040247K0FKEDH; Supplier Part Number 2: 541-47.0KYCT-ND; Mouser Part Number: 71-CRCW0402-47K-E3
U13 = IC - TXS0108EPW: Translation - Voltage Levels 8B Bidir Vltg-Level Translator; Supply Voltage - Max: 5.5V; Supply Voltage - Min: 1.2V; Height: 1.2mm; Mouser Part Number: 595-TXS0108EPWR; ComponentLink1Description: DataSheet; ComponentLink1URL: https://www.ti.com/lit/ds/symlink/txs0108e.pdf?HQS=dis-mous-null-mousermode-dsf-pf-null-wwe&ts=1609232216318&ref_url=https%253A%252F%252Fwww.mouser.com.tr%252F; Maximum Operating Temperature: +85; Minimum Operating Temperature: -40; ComponentLink2Description: Mouser; ComponentLink2URL: https://www.mouser.com.tr/ProductDetail/Texas-Instruments/TXS0108EPWR/?qs=IUbkBnfnSQLgiWtCbWtYOw%3D%3D; Supplier 2: Mouser; Supplier 3: Digi-Key; Supplier 4: Digi-Key; Supplier 5: Digi-Key; Supplier 6: Farnell; Supplier 7: Farnell; Supplier 8: Farnell; Supplier 9: RSComponents; Supplier 10: RSComponents; Supplier 1: Arrow Electronics; Supplier Part Number 1: TXS0108EPWR; Supplier Part Number 2: 595-TXS0108EPWR; Supplier Part Number 3: 296-23011-1-ND; Supplier Part Number 4: 296-23011-6-ND; Supplier Part Number 5: 296-23011-2-ND; Supplier Part Number 6: 1702548; Supplier Part Number 7: 1702548RL; Supplier Part Number 8: 2437921; Supplier Part Number 9: 7094639P; Supplier Part Number 10: 7094639; Case: TSSOP-20

## Sheet FOTA MicroController.SchDoc: FOTA MicroController
size A3; ApprovedBy: Mehmet Günce Akkoyun; CheckedBy: Mehmet Günce Akkoyun; Author: Mehmet Günce Akkoyun; CompanyName: Ovoo Electronics; DrawnBy: Mehmet Günce Akkoyun; Engineer: Mehmet Günce Akkoyun; Organization: Ovoo Electronics; Address1: Necip Fazıl Mah. Ortaırmak Sok.; Address2: Birgül Apt. No: 19/6; Address3: Meram / Konya; Address4: Turkiye; DocumentNumber: 45; Revision: R06; SheetNumber: 45; SheetTotal: 54
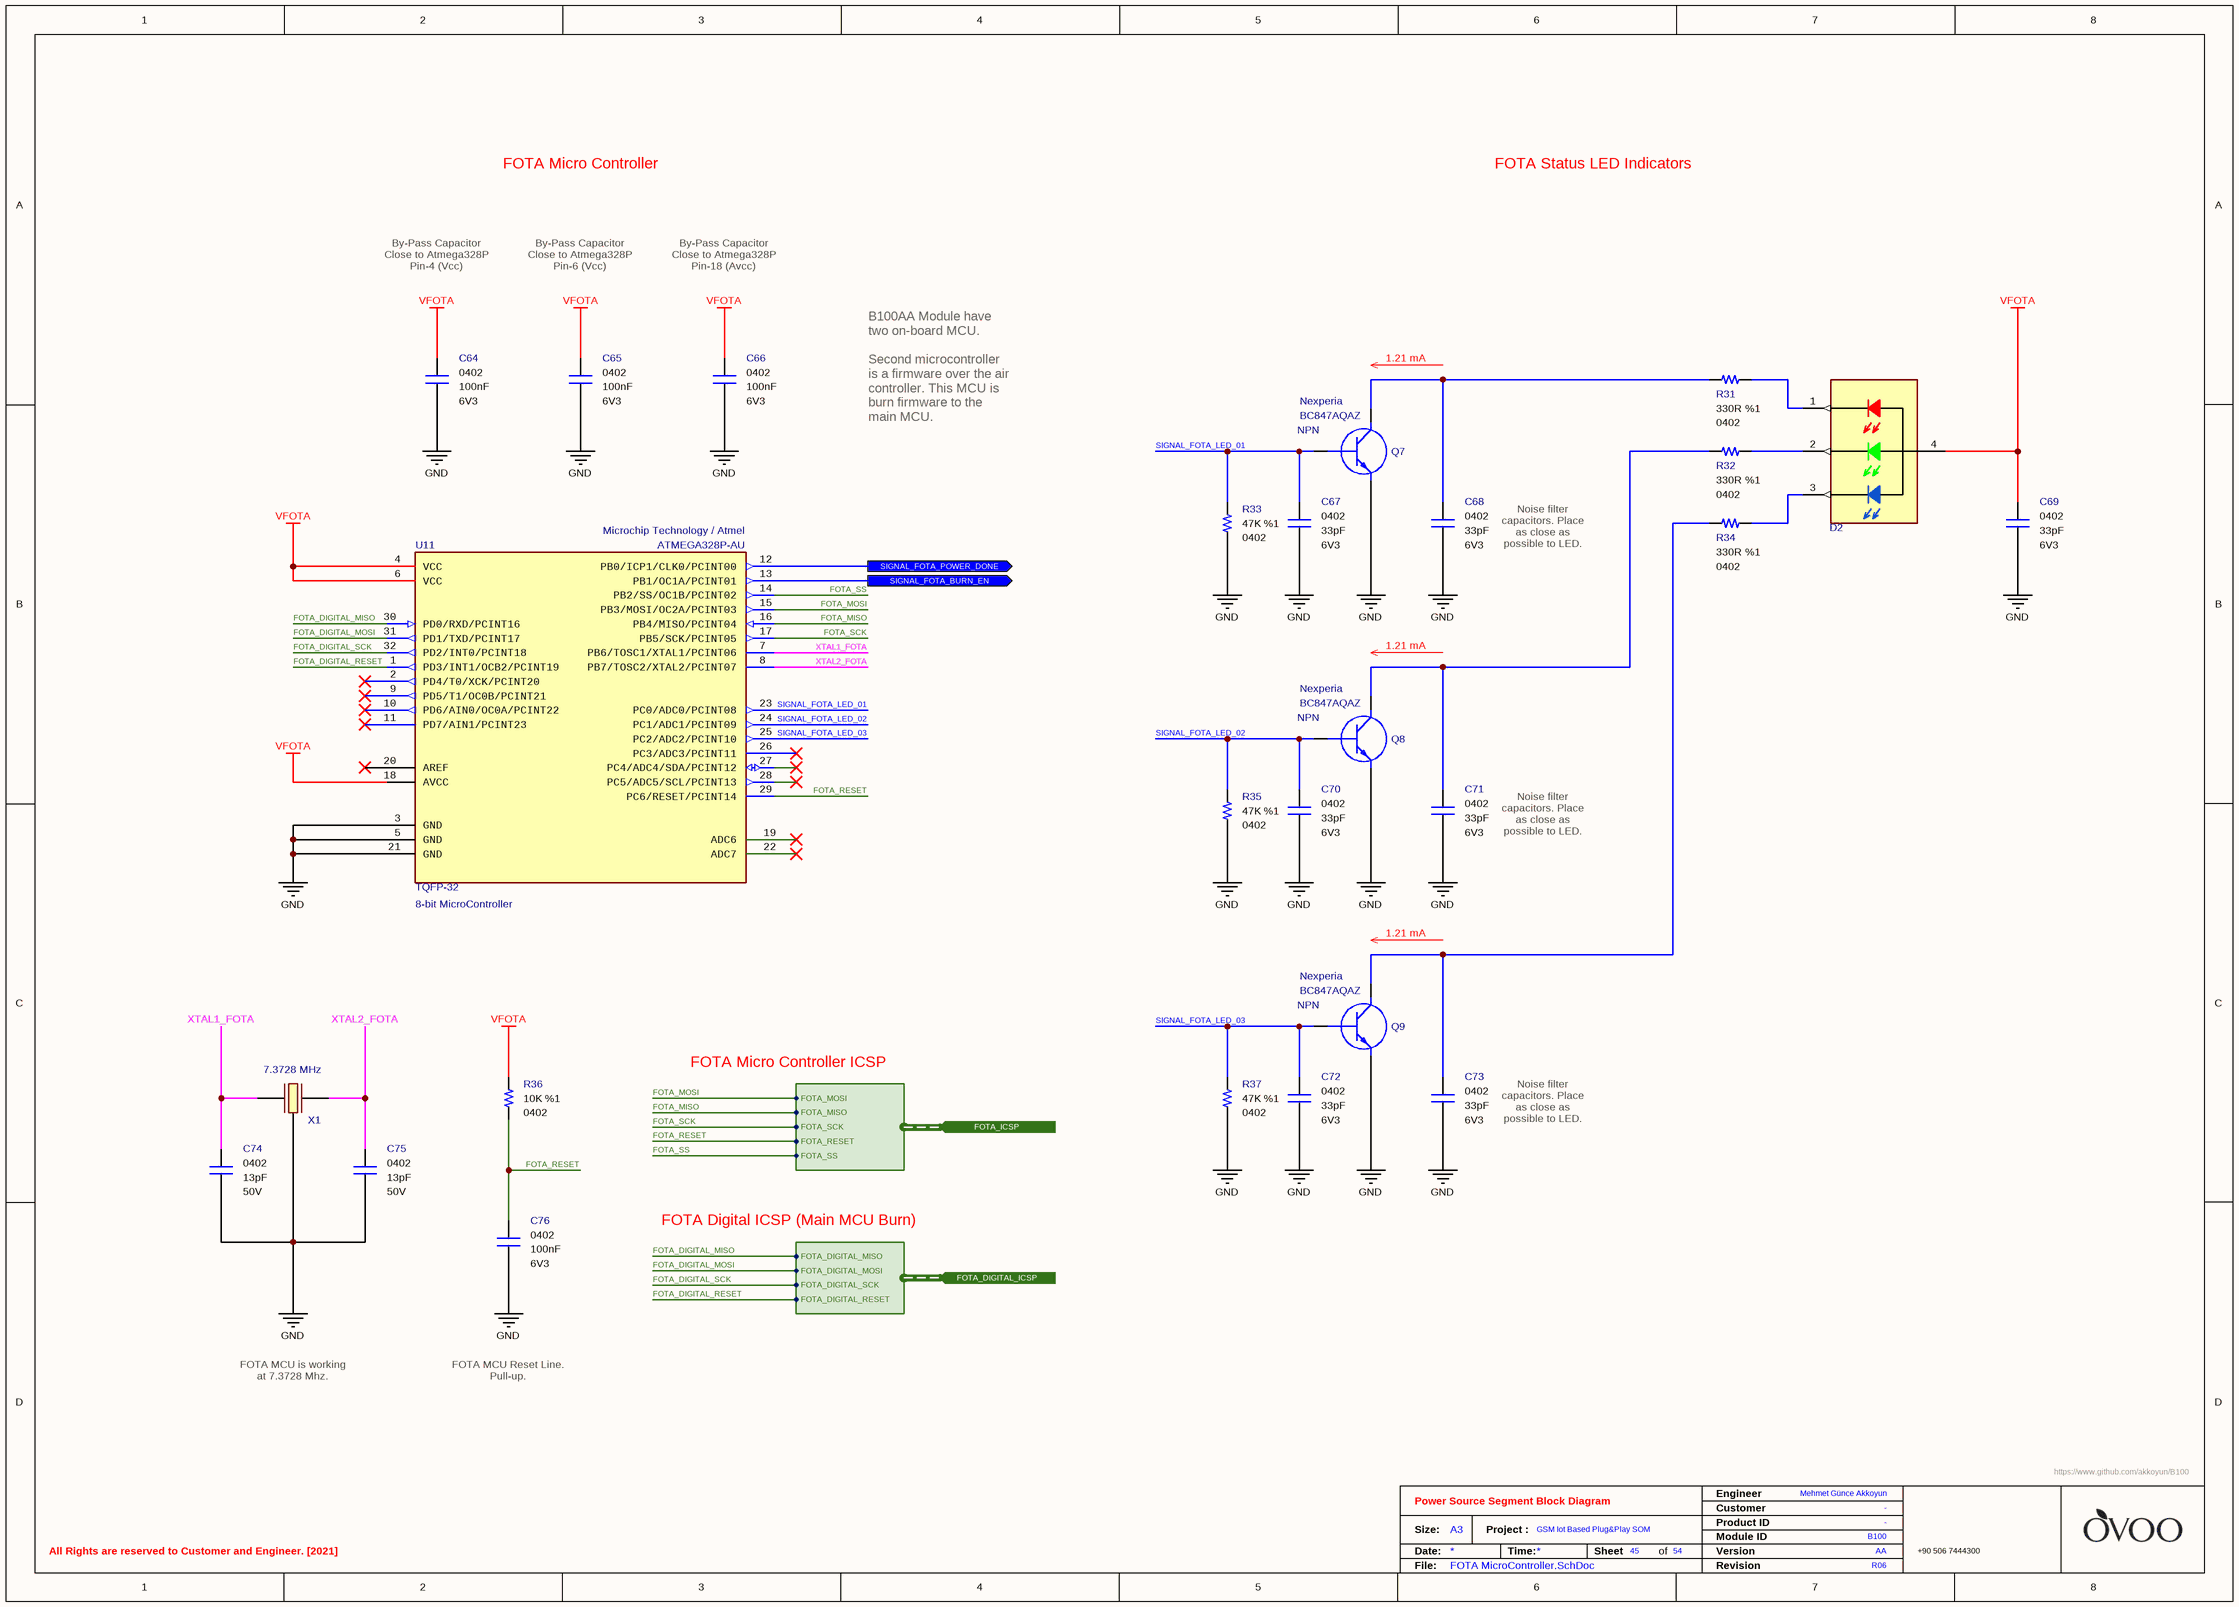
[diagram p54: FOTA MicroController.SchDoc]

### Parts
C64  value 100nF  Case: 0402  Voltage: 6V3  [CAPACITOR_0402]  (hidden comment: Multilayer Ceramic Capacitor)
C65  value 100nF  Case: 0402  Voltage: 6V3  [CAPACITOR_0402]  (hidden comment: Multilayer Ceramic Capacitor)
C66  value 100nF  Case: 0402  Voltage: 6V3  [CAPACITOR_0402]  (hidden comment: Multilayer Ceramic Capacitor)
C67  value 33pF  Case: 0402  Voltage: 6V3  [CAPACITOR_0402]  (hidden comment: Multilayer Ceramic Capacitor)
C68  value 33pF  Case: 0402  Voltage: 6V3  [CAPACITOR_0402]  (hidden comment: Multilayer Ceramic Capacitor)
C69  value 33pF  Case: 0402  Voltage: 6V3  [CAPACITOR_0402]  (hidden comment: Multilayer Ceramic Capacitor)
C70  value 33pF  Case: 0402  Voltage: 6V3  [CAPACITOR_0402]  (hidden comment: Multilayer Ceramic Capacitor)
C71  value 33pF  Case: 0402  Voltage: 6V3  [CAPACITOR_0402]  (hidden comment: Multilayer Ceramic Capacitor)
C72  value 33pF  Case: 0402  Voltage: 6V3  [CAPACITOR_0402]  (hidden comment: Multilayer Ceramic Capacitor)
C73  value 33pF  Case: 0402  Voltage: 6V3  [CAPACITOR_0402]  (hidden comment: Multilayer Ceramic Capacitor)
C74  value 13pF  Voltage: 50V  Case: 0402  [CAPACITOR_0402]  (hidden comment: Multilayer Ceramic Capacitor)
C75  value 13pF  Voltage: 50V  Case: 0402  [CAPACITOR_0402]  (hidden comment: Multilayer Ceramic Capacitor)
C76  value 100nF  Case: 0402  Voltage: 6V3  [CAPACITOR_0402]  (hidden comment: Multilayer Ceramic Capacitor)
D2  150066M153000  [Wurth_0606]  (value not drawn)
Q7  Polarity: NPN  Manufacturer Name: Nexperia  [SOT1215]  (hidden comment: BC847AQAZ)
Q8  Polarity: NPN  Manufacturer Name: Nexperia  [SOT1215]  (hidden comment: BC847AQAZ)
Q9  Polarity: NPN  Manufacturer Name: Nexperia  [SOT1215]  (hidden comment: BC847AQAZ)
R31  value 330R  Tolerance: %1  Case: 0402  [RESISTOR_0402]  (hidden comment: 330R - 0402 - %1 - 1/16W)
R32  value 330R  Tolerance: %1  Case: 0402  [RESISTOR_0402]  (hidden comment: 330R - 0402 - %1 - 1/16W)
R33  value 47K  Tolerance: %1  Case: 0402  [RESISTOR_0402]  (hidden comment: 47K - 0402 - %1 - 1/16W)
R34  value 330R  Tolerance: %1  Case: 0402  [RESISTOR_0402]  (hidden comment: 330R - 0402 - %1 - 1/16W)
R35  value 47K  Tolerance: %1  Case: 0402  [RESISTOR_0402]  (hidden comment: 47K - 0402 - %1 - 1/16W)
R36  value 10K  Tolerance: %1  Case: 0402  [RESISTOR_0402]  (hidden comment: Thick Film Resistor)
R37  value 47K  Tolerance: %1  Case: 0402  [RESISTOR_0402]  (hidden comment: 47K - 0402 - %1 - 1/16W)
U11  8-bit MicroController  Case: TQFP-32  Manufacturer Part Number: ATMEGA328P-AU  Manufacturer Name: Microchip Technology / Atmel  [TQFP32]
X1  7.3728 MHz  [ABRACON_CRYSTAL]

### Ports
FOTA_DIGITAL_ICSP (in, harness FOTA_DIGITAL_ICSP), FOTA_ICSP (in, harness FOTA_ICSP), SIGNAL_FOTA_BURN_EN (out), SIGNAL_FOTA_POWER_DONE (out)

### Harnesses
FOTA_ICSP: FOTA_RESET, FOTA_SCK, FOTA_MISO, FOTA_MOSI, FOTA_SS
FOTA_DIGITAL_ICSP: FOTA_DIGITAL_SCK, FOTA_DIGITAL_MOSI, FOTA_DIGITAL_MISO, FOTA_DIGITAL_RESET

### Nets
GND: C64.1 C65.1 C66.1 C67.2 C68.2 C69.2 C70.2 C71.2 C72.2 C73.2 C74.1 C75.1 C76.1 Q7.2(E) Q8.2(E) Q9.2(E) R33.1 R35.1 R37.1 U11.3(GND) U11.5(GND) U11.21(GND) X1.2(GND)
VFOTA: C64.2 C65.2 C66.2 C69.1 D2.4 R36.2 U11.4(VCC) U11.6(VCC) U11.18(AVCC)
FOTA_DIGITAL_MISO: U11.30(PD0/RXD/PCINT16) ; port FOTA_DIGITAL_ICSP.FOTA_DIGITAL_MISO  [project net FOTA_DIGITAL_ICSP.FOTA_DIGITAL_MISO]
FOTA_DIGITAL_MOSI: U11.31(PD1/TXD/PCINT17) ; port FOTA_DIGITAL_ICSP.FOTA_DIGITAL_MOSI  [project net FOTA_DIGITAL_ICSP.FOTA_DIGITAL_MOSI]
FOTA_DIGITAL_RESET: U11.1(PD3/INT1/OCB2/PCINT19) ; port FOTA_DIGITAL_ICSP.FOTA_DIGITAL_RESET  [project net FOTA_DIGITAL_ICSP.FOTA_DIGITAL_RESET]
FOTA_DIGITAL_SCK: U11.32(PD2/INT0/PCINT18) ; port FOTA_DIGITAL_ICSP.FOTA_DIGITAL_SCK  [project net FOTA_DIGITAL_ICSP.FOTA_DIGITAL_SCK]
FOTA_MISO: U11.16(PB4/MISO/PCINT04) ; port FOTA_ICSP.FOTA_MISO  [project net FOTA_ICSP.FOTA_MISO]
FOTA_MOSI: U11.15(PB3/MOSI/OC2A/PCINT03) ; port FOTA_ICSP.FOTA_MOSI  [project net FOTA_ICSP.FOTA_MOSI]
FOTA_RESET: C76.2 R36.1 U11.29(PC6/RESET/PCINT14) ; port FOTA_ICSP.FOTA_RESET  [project net FOTA_ICSP.FOTA_RESET]
FOTA_SCK: U11.17(PB5/SCK/PCINT05) ; port FOTA_ICSP.FOTA_SCK  [project net FOTA_ICSP.FOTA_SCK]
FOTA_SS: U11.14(PB2/SS/OC1B/PCINT02) ; port FOTA_ICSP.FOTA_SS  [project net FOTA_ICSP.FOTA_SS]
SIGNAL_FOTA_BURN_EN: U11.13(PB1/OC1A/PCINT01) ; port SIGNAL_FOTA_BURN_EN
SIGNAL_FOTA_LED_01: C67.1 Q7.1(B) R33.2 U11.23(PC0/ADC0/PCINT08)
SIGNAL_FOTA_LED_02: C70.1 Q8.1(B) R35.2 U11.24(PC1/ADC1/PCINT09)
SIGNAL_FOTA_LED_03: C72.1 Q9.1(B) R37.2 U11.25(PC2/ADC2/PCINT10)
SIGNAL_FOTA_POWER_DONE: U11.12(PB0/ICP1/CLK0/PCINT00) ; port SIGNAL_FOTA_POWER_DONE
XTAL1_FOTA: C74.2 U11.7(PB6/TOSC1/XTAL1/PCINT06) X1.3(OUT/IN)
XTAL2_FOTA: C75.2 U11.8(PB7/TOSC2/XTAL2/PCINT07) X1.1(IN/OUT)
NetC68_1: C68.1 Q7.3(C) R31.1
NetC71_1: C71.1 Q8.3(C) R32.1
NetC73_1: C73.1 Q9.3(C) R34.1
NetD2_1: D2.1 R31.2
NetD2_2: D2.2 R32.2
NetD2_3: D2.3 R34.2

Not connected (* = marked no-connect by the designer): U11 2(PD4/T0/XCK/PCINT20)* 9(PD5/T1/OC0B/PCINT21)* 10(PD6/AIN0/OC0A/PCINT22)* 11(PD7/AIN1/PCINT23)* 19(ADC6)* 20(AREF)* 22(ADC7)* 26(PC3/ADC3/PCINT11)* 27(PC4/ADC4/SDA/PCINT12)* 28(PC5/ADC5/SCL/PCINT13)*; X1 4(GND)

### Notes on the sheet
- FOTA Micro Controller
- FOTA Status LED Indicators
- By-Pass Capacitor
  Close to Atmega328P
  Pin-4 (Vcc)
- By-Pass Capacitor
  Close to Atmega328P
  Pin-6 (Vcc)
- By-Pass Capacitor
  Close to Atmega328P
  Pin-18 (Avcc)
- 1.21 mA
- B100AA Module have two on-board MCU.
  Second microcontroller is a firmware over the air controller. This MCU is burn firmware to the main MCU.
- Noise filter capacitors. Place as close as possible to LED.
- FOTA Micro Controller ICSP
- FOTA Digital ICSP (Main MCU Burn)
- FOTA MCU is working at 7.3728 Mhz.
- FOTA MCU Reset Line. Pull-up.
- Engineer
- All Rights are reserved to Customer and Engineer. [2021]
- Size:
- Date:
- A3
- Project :
- Time:
- Sheet
- of
- Customer
- Product ID
- Module ID
- Version
- File:
- Revision

### Library data of the parts
C64-C66 C76 = Capacitor - 100nF [0402-6V3]: as C60 on sheet FOTA MicroController Power Switch; Height: 0.25mm; ComponentLink1Description: Mouser; ComponentLink1URL: https://www.mouser.com.tr/ProductDetail/AVX/04026D104KAT4A?qs=sGAEpiMZZMs0AnBnWHyRQPg4iYkCw7IMED%2F4kpqgf7w%3D; ComponentLink2Description: DataSheet; ComponentLink2URL: https://www.mouser.com.tr/datasheet/2/40/cx5r-776519.pdf; ROHS: Yes; Maximum Operating Temperature: +85; Minimum Operating Temperature: -55; Supplier 1: Avnet; Supplier Part Number 1: 04026D104KAT4A; Mouser Part Number: 581-04026D104KAT4A
C67-C73 = Capacitor - 33pF [0402-6V3]: as C62 on sheet FOTA MicroController Power Switch; Height: 0.5mm; Maximum Operating Temperature: +125; Minimum Operating Temperature: -55; ROHS: Yes; ComponentLink1Description: DataSheet; ComponentLink1URL: https://api.kemet.com/component-edge/download/datasheet/C0402C330J9RACAUTO.pdf; ComponentLink2Description: Mouser; ComponentLink2URL: https://www.mouser.com/Search/Refine.aspx?Keyword=80-C0402C330J9RAUTO; Supplier 1: Mouser; Supplier Part Number 1: 80-C0402C330J9RAUTO; Mouser Part Number: 80-C0402C330J9RAUTO
C74 C75 = Capacitor - 13pF [0402-50V]: Capacitor - 13pF [0402] (Ceramic); Manufacturer Name: Kemet; Manufacturer Part Number: CBR04C130F5GAC; Dielectric: C0G; Tolerance: 1%; Height: 0.55mm; ROHS: Yes; Weight: 0.65mg; ComponentLink1Description: DataSheet; ComponentLink1URL: http://www.kemet.com/Lists/ProductCatalog/Attachments/490/KEM_C1030_CBR_SMD.pdf; ComponentLink2Description: Mouser; ComponentLink2URL: http://www.mouser.com/Search/ProductDetail.aspx?qs=kSX8PZDGYstn%252bRHasf81FA%3d%3d; Supplier 1: Mouser; Supplier 2: Farnell; Supplier 3: Digi-Key; Supplier Part Number 3: 399-8812-1-ND; Supplier Part Number 2: 2773390; Supplier Part Number 1: 80-CBR04C130F5GAC; Mouser Part Number: 80-CBR04C130F5GAC
D2 = Diode - RGB LED (150066M153000): Standard LEDs - SMD PICOLED series Red LED; Manufacturer Name: Wurth Elektronik; Datasheet Link: https://www.mouser.com.tr/datasheet/2/445/150066M153000-1715259.pdf; Manufacturer Part Number: 150066M153000; Mouser Part Number: 710-150066M153000; Mouser Price/Stock: https://www.mouser.com.tr/ProductDetail/ROHM-Semiconductor/SML-P12U2TT86R?qs=sGAEpiMZZMseGfSY3csMkRIBDsfU3UCXJTULB5gem9Ta%252Bp%252BvZ709fg%3D%3D; Case: 0606; ROHS: Yes; Supplier 1: RSComponents; Supplier 2: RSComponents; Supplier 3: Mouser; Supplier 4: Farnell; Supplier 5: Digi-Key; Supplier 6: Digi-Key; Supplier 7: Digi-Key; Supplier 8: Newark; Supplier Part Number 1: 1765006; Supplier Part Number 2: 1766050; Supplier Part Number 3: 710-150066M153000; Supplier Part Number 4: 2764964; Supplier Part Number 5: 732-11390-1-ND; Supplier Part Number 6: 732-11390-6-ND; Supplier Part Number 7: 732-11390-2-ND; Supplier Part Number 8: 22AC3253
Q7-Q9 = Transistor - BC847: Bipolar NPN Transistors; Case: DFN-1010D-3; Supplier 1: Digi-Key; Supplier 2: Digi-Key; Supplier Part Number 1: 1727-2545-1-ND; Supplier Part Number 2: 1727-2545-6-ND; Supplier 3: Avnet; Supplier 4: Arrow Electronics; Supplier 5: Mouser; Supplier 6: Newark; Supplier 7: Digi-Key; Supplier 8: Farnell; Supplier 9: Farnell; Supplier Part Number 3: BC847AQAZ; Supplier Part Number 4: BC847AQAZ; Supplier Part Number 5: 771-BC847AQAZ; Supplier Part Number 6: 82Y6125; Supplier Part Number 7: 1727-2545-2-ND; Supplier Part Number 8: 2545344; Supplier Part Number 9: 2545344RL; Manufacturer Part Number: BC847AQAZ
R31 R32 R34 = Resistor - 330R: as R27 on sheet FOTA MicroController Power Switch; Height: 0.4mm; ComponentLink1Description: DataSheet; ComponentLink1URL: https://www.mouser.com.tr/datasheet/2/427/dcrcwe3-1762152.pdf; ComponentLink2Description: Mouser; ComponentLink2URL: https://www.mouser.com.tr/ProductDetail/Vishay-Dale/CRCW0402330RFKED?qs=sGAEpiMZZMu61qfTUdNhG2DpbjADlD3GGS6SwBlLi5Q%3D; Supplier 1: Digi-Key; Supplier 2: Digi-Key; Supplier Part Number 2: 541-330LDKR-ND; Supplier Part Number 1: 541-330LCT-ND; Mouser Part Number: 71-CRCW0402-330-E3; Supplier 3: Digi-Key; Supplier 4: Newark; Supplier 5: Newark; Supplier 6: RSComponents; Supplier 7: RSComponents; Supplier 8: Future Electronics; Supplier 9: Future Electronics; Supplier 10: Newark; Supplier 11: Newark; Supplier 12: Arrow Electronics; Supplier 13: Mouser; Supplier 14: Avnet; Supplier 15: Farnell; Supplier 16: Farnell; Supplier 17: Farnell; Supplier 18: Allied Electronics; Supplier 19: Allied Electronics; Supplier 20: Avnet; Supplier 21: Avnet; Supplier 22: Future Electronics; Supplier 23: Future Electronics; Supplier 24: Newark; Supplier 25: RSComponents; Supplier 26: RSComponents; Supplier Part Number 3: 541-330LTR-ND; Supplier Part Number 4: 52K6981; Supplier Part Number 5: 61M5301; Supplier Part Number 6: 6789178P; Supplier Part Number 7: 6789178; Supplier Part Number 9: 9848185; Supplier Part Number 8: 4103726; Supplier Part Number 10: 25AC7117; Supplier Part Number 11: 42K3473; Supplier Part Number 26: 1819488; Supplier Part Number 25: 1688408; Supplier Part Number 24: 24W2220; Supplier Part Number 23: CRCW0402330RFKED-REEL; Supplier Part Number 22: CRCW0402330RFKED-CUTT; Supplier Part Number 21: 52K6981; Supplier Part Number 20: 42K3473; Supplier Part Number 19: 70272759; Supplier Part Number 18: 70202255; Supplier Part Number 17: 1469709RL; Supplier Part Number 16: 2121540; Supplier Part Number 15: 1469709; Supplier Part Number 14: CRCW0402330RFKED; Supplier Part Number 13: 71-CRCW0402-330-E3; Supplier Part Number 12: CRCW0402330RFKED
R33 R35 R37 = Resistor - 47K: as R29 on sheet FOTA MicroController Power Switch; Height: 0.4mm; ComponentLink1Description: DataSheet; ComponentLink1URL: https://www.mouser.com.tr/datasheet/2/427/dcrcwe3-1762152.pdf; ComponentLink2Description: Mouser; ComponentLink2URL: https://www.mouser.com.tr/ProductDetail/Vishay-Dale/CRCW040247K0FKED?qs=sGAEpiMZZMu61qfTUdNhG2DpbjADlD3GL%252B3h1elTxqU%3D; Supplier 1: RSComponents; Supplier 2: Newark; Supplier Part Number 1: 6789361P; Supplier Part Number 2: 52K7097; Supplier 3: Avnet; Supplier 4: RSComponents; Supplier 5: Future Electronics; Supplier 6: Future Electronics; Supplier 7: Newark; Supplier 8: Arrow Electronics; Supplier 9: Mouser; Supplier 10: Newark; Supplier 11: Avnet; Supplier 12: Digi-Key; Supplier 13: Digi-Key; Supplier 14: Digi-Key; Supplier 15: Newark; Supplier 16: Farnell; Supplier 17: Farnell; Supplier 18: Farnell; Supplier 19: Allied Electronics; Supplier 20: Allied Electronics; Supplier 21: Avnet; Supplier 22: Future Electronics; Supplier 23: Future Electronics; Supplier 24: Future Electronics; Supplier 25: Newark; Supplier 26: RSComponents; Supplier 27: RSComponents; Supplier Part Number 3: 52K7097; Supplier Part Number 4: 6789361; Supplier Part Number 5: 2103738; Supplier Part Number 6: 7521222; Supplier Part Number 7: 42K3500; Supplier Part Number 8: CRCW040247K0FKED; Supplier Part Number 12: 541-47.0KLCT-ND; Supplier Part Number 14: 541-47.0KLTR-ND; Supplier Part Number 10: 61M5310; Supplier Part Number 9: 71-CRCW0402-47K-E3; Supplier Part Number 13: 541-47.0KLDKR-ND; Supplier Part Number 11: CRCW040247K0FKED; Supplier Part Number 15: 25AC7165; Supplier Part Number 16: 1469719; Supplier Part Number 18: 2121814; Supplier Part Number 17: 1469719RL; Supplier Part Number 19: 70202660; Supplier Part Number 20: 70272767; Supplier Part Number 21: 42K3500; Supplier Part Number 22: 6128776; Supplier Part Number 24: CRCW040247K0FKED-REEL; Supplier Part Number 23: CRCW040247K0FKED-CUTT; Supplier Part Number 25: 24W2315; Supplier Part Number 26: 1688455; Supplier Part Number 27: 1823505
R36 = Resistor - 10K: as R38-R41 on sheet SD Card; Height: 0.4mm; ComponentLink1Description: DataSheet; ComponentLink1URL: https://www.mouser.com.tr/datasheet/2/427/dcrcwe3-1762152.pdf; ComponentLink2Description: Mouser; ComponentLink2URL: https://www.mouser.com.tr/ProductDetail/Vishay-Dale/CRCW040210K0FKED?qs=sGAEpiMZZMu61qfTUdNhG2DpbjADlD3GcalbOv9utCY%3D; Supplier 1: Mouser; Supplier 2: Digi-Key; Supplier Part Number 1: 71-CRCW040210K0FKEDH; Supplier Part Number 2: 541-10.0KYCT-ND; Mouser Part Number: 71-CRCW0402-10K-E3
U11 = IC - ATMEGA328P: 8-bit Microcontrollers - MCU 32KB In-system Flash 20MHz 1.8V-5.5V; Supply Voltage - Min: 1.8V; Supply Voltage - Max: 5.5V; Height: 1mm; ComponentLink1Description: DataSheet; ComponentLink1URL: http://ww1.microchip.com/downloads/en/DeviceDoc/ATmega48A-PA-88A-PA-168A-PA-328-P-DS-DS40002061A.pdf; ROHS: Yes; Minimum Operating Temperature: -40; Maximum Operating Temperature: +85; ComponentLink2Description: Mouser; ComponentLink2URL: https://www.mouser.com.tr/ProductDetail/Microchip-Technology-Atmel/ATMEGA328P-AU?qs=sGAEpiMZZMtVoztFdqDXO3RbBx7FKCmV; ComponentLink3Description: ProductPage; ComponentLink3URL: https://www.microchip.com/wwwproducts/en/ATmega328p; Supplier 1: Avnet; Supplier 2: Mouser; Supplier 3: Arrow; Supplier 4: Digi-Key; Supplier Part Number 1: ATMEGA328P-AU; Supplier Part Number 2: 556-ATMEGA328P-AU; Supplier Part Number 3: ATMEGA328P-AU; Supplier Part Number 4: ATMEGA328P-AU-ND; Mouser Part Number: 556-ATMEGA328P-AU
X1 = Crystal - 7.3728 MHz (Abracon): Crystals 7.3728MHz 18pF -40C +85C; Manufacturer Part Number: ABMM2-7.3728MHZ-E2-T; ESR: 150 Ohms; Frequency Stability: 20 ppm; Height: 1.2 mm; Frequency: 7.3728 MHz; Maximum Operating Temperature: +70; Minimum Operating Temperature: -20; ROHS: Yes; Tolerance: 20 ppm; ComponentLink1Description: DataSheet; ComponentLink1URL: https://www.ecsxtal.com/store/pdf/csm-8mr.pdf; ComponentLink2Description: Mouser; ComponentLink2URL: https://www.mouser.com/Search/Refine.aspx?Keyword=520-7.3-18-20BM-JENT; Supplier 1: Mouser; Supplier 2: Arrow; Supplier Part Number 2: ABMM2-7.3728MHZ-E2-T; Supplier Part Number 1: 815-ABMM2-7.3-E2-T; Manufacturer Name: ABRACON; Mouser Part Number: 815-ABMM2-7.3-E2-T; Case: SMD